# Altium project AccelerometerUSB.PrjPcb
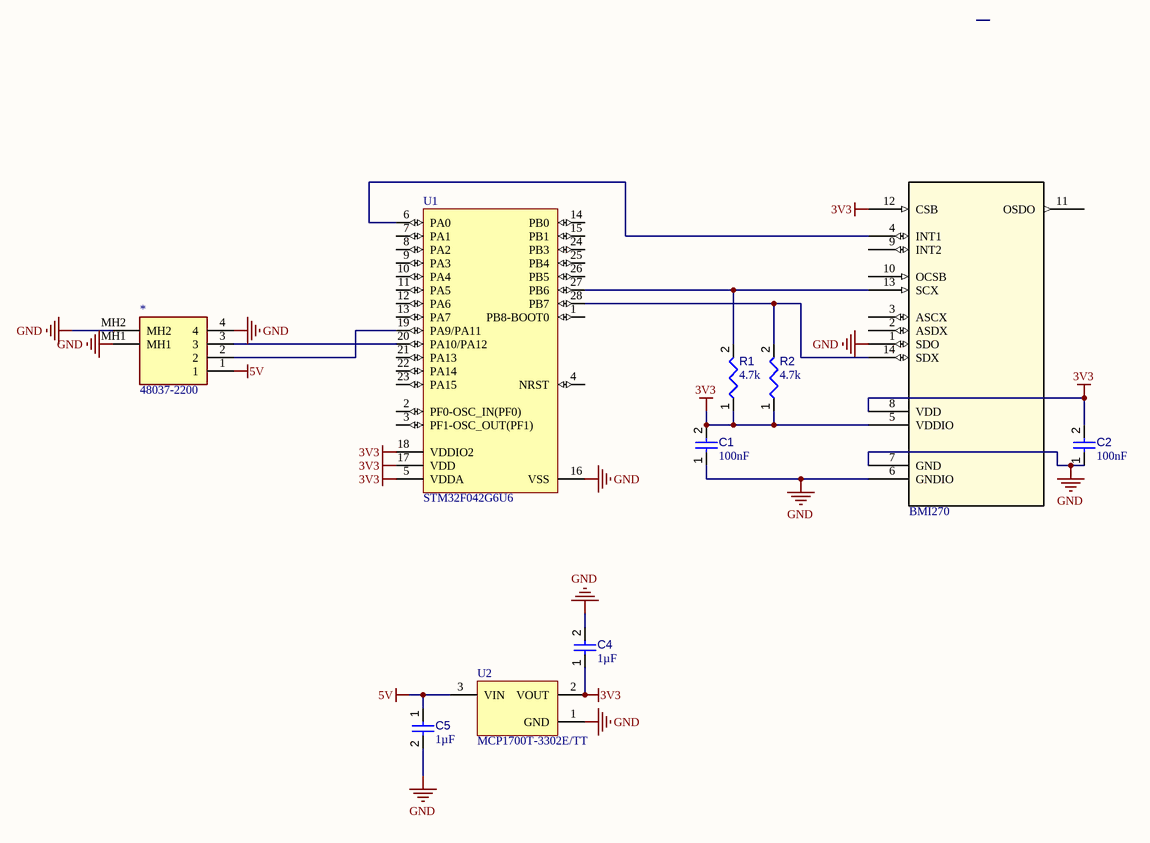
[diagram p0: AccelerometerUSB.SchDoc]
1 sheet, 10 parts. Net scope: global (net labels, ports and power ports of the same name join across sheets).

## Sheet AccelerometerUSB.SchDoc
size A4; SheetNumber: 1; SheetTotal: 1

### Parts
*  48037-2200  [48037-2200-Footprint-1]
?  BMI270  [BMI270-Footprint-1]
C1  value 100nF  [CAPC1608X90X40NL10T20]  (hidden comment: Capacitor 100 nF +/-10% 50 V 0603)
C2  value 100nF  [CAPC1608X90X40NL10T20]  (hidden comment: Capacitor 100 nF +/-10% 50 V 0603)
C4  value 1µF  [CAPC1608X94X35NL15T15]  (hidden comment: Capacitor 1 uF +/- 10% 16 V 0603)
C5  value 1µF  [CAPC1608X94X35NL15T15]  (hidden comment: Capacitor 1 uF +/- 10% 16 V 0603)
R1  value 4.7k  [RESC1608X55X25ML10T15]  (hidden comment: Resistor 4k7 +/-1% 0603 100 mW)
R2  value 4.7k  [RESC1608X55X25ML10T15]  (hidden comment: Resistor 4k7 +/-1% 0603 100 mW)
U1  STM32F042G6U6  [STM-UFQFPN28_V]
U2  MCP1700T-3302E/TT  [SOT-23-TT3_N]

### Nets
3V3: ?.5(VDDIO) ?.8(VDD) ?.12(CSB) C1.2 C2.2 C4.1 R1.1 R2.1 U1.5(VDDA) U1.17(VDD) U1.18(VDDIO2) U2.2(VOUT)
5V: *.1 C5.1 U2.3(VIN)
GND: *.4 *.MH1 *.MH2 ?.1(SDO) ?.6(GNDIO) ?.7(GND) C1.1 C2.1 C4.2 C5.2 U1.16(VSS) U2.1(GND)
Net*_2: *.2 U1.19(PA9/PA11)
Net*_3: *.3 U1.20(PA10/PA12)
Net?_4: ?.4(INT1) U1.6(PA0)
Net?_13: ?.13(SCX) R1.2 U1.27(PB6)
Net?_14: ?.14(SDX) R2.2 U1.28(PB7)

Not connected (* = marked no-connect by the designer): ? 2(ASDX) 3(ASCX) 9(INT2) 10(OCSB) 11(OSDO); U1 1(PB8-BOOT0) 2(PF0-OSC_IN(PF0)) 3(PF1-OSC_OUT(PF1)) 4(NRST) 7(PA1) 8(PA2) 9(PA3) 10(PA4) 11(PA5) 12(PA6) 13(PA7) 14(PB0) 15(PB1) 21(PA13) 22(PA14) 23(PA15) 24(PB3) 25(PB4) 26(PB5)

### Library data of the parts
* = CMP-002-00073-1: USB Connector, Plug, USB 2.0, USB Type A, 4 Ways, Gold, SMT, Right Angle, Brass, 48037 Series; Gender: Male; Voltage Rating: 150V; Min Operating Temperature: -20°C; Connector Type: Plug, USB; Mounting Technology: Surface Mount; Max Operating Temperature: 85°C; Pins: 4
? = CMP-010-00025-2: Inertial Measurement Unit Digital Output 1.8V/2.5V/3.3V Automotive 14-Pin LGA
C1 C2 = CMP-001-00017-6: Chip Capacitor, 100 nF, +/- 10%, 50 V, 0603 (1608 Metric); Voltage Rating: 50V; Capacitor Type: Ceramic; Tolerance: 10%; Mounting Technology: SM; Max Operating Temperature: 125°C; RoHS Compliant: True; Pins: 2; Case/Package: 0603; Min Operating Temperature: -55°C
C4 C5 = CMP-001-00003-6: Chip Capacitor, 1 uF, +/- 10%, 16 V, 0603 (1608 Metric); Voltage Rating: 16V; Capacitor Type: Ceramic; Max Operating Temperature: 125°C; Pins: 2; Tolerance: 10%; Min Operating Temperature: -55°C; RoHS Compliant: True; Mounting Technology: SM; Case/Package: 0603
R1 R2 = CMP-009-00031-5: Chip Resistor, 4.7 KOhm, +/- 1%, 0.1 W, -55 to 155 degC, 0603 (1608 Metric); Power: 100mW; Tolerance: 1%; Mounting Technology: SM; Case/Package: 0603; RoHS Compliant: True; Pins: 2; Min Operating Temperature: -55°C; Max Operating Temperature: 155°C
U1 = CMP-020-00024-1: MCU 32-bit ARM Cortex M0 RISC 32KB Flash 2.5V/3.3V 28-Pin UFQFPN Frame; Frequency: 48MHz; Interface: CAN, I2C, I2S, IrDA, LIN, SPI, USB; Max Supply Voltage: 3.6V; RAM Size: 6kB; Min Supply Voltage: 2V; Clock Frequency: 48MHz; Max Operating Temperature: 85°C; Pins: 28; Mounting Technology: Surface Mount; Min Operating Temperature: -40°C; Case/Package: UFQFPN
U2 = CMP-0136-00791-1: Low Quiescent Current LDO, 3-Pin SOT-23, Extended Temperature, Tape and Reel; PackageVersion: revBB, Aug-2009; Code_IPC: SOT23-3; PackageReference: SOT-23-TT3; DatasheetVersion: revB, Feb-2007; PackageDescription: 3-Lead Plastic Small Outline Transistor (TT) [SOT-23]